# Altium project PCB_Project.PrjPCB (part 2 of 2)

## Sheet PWR_IN.SchDoc
size C
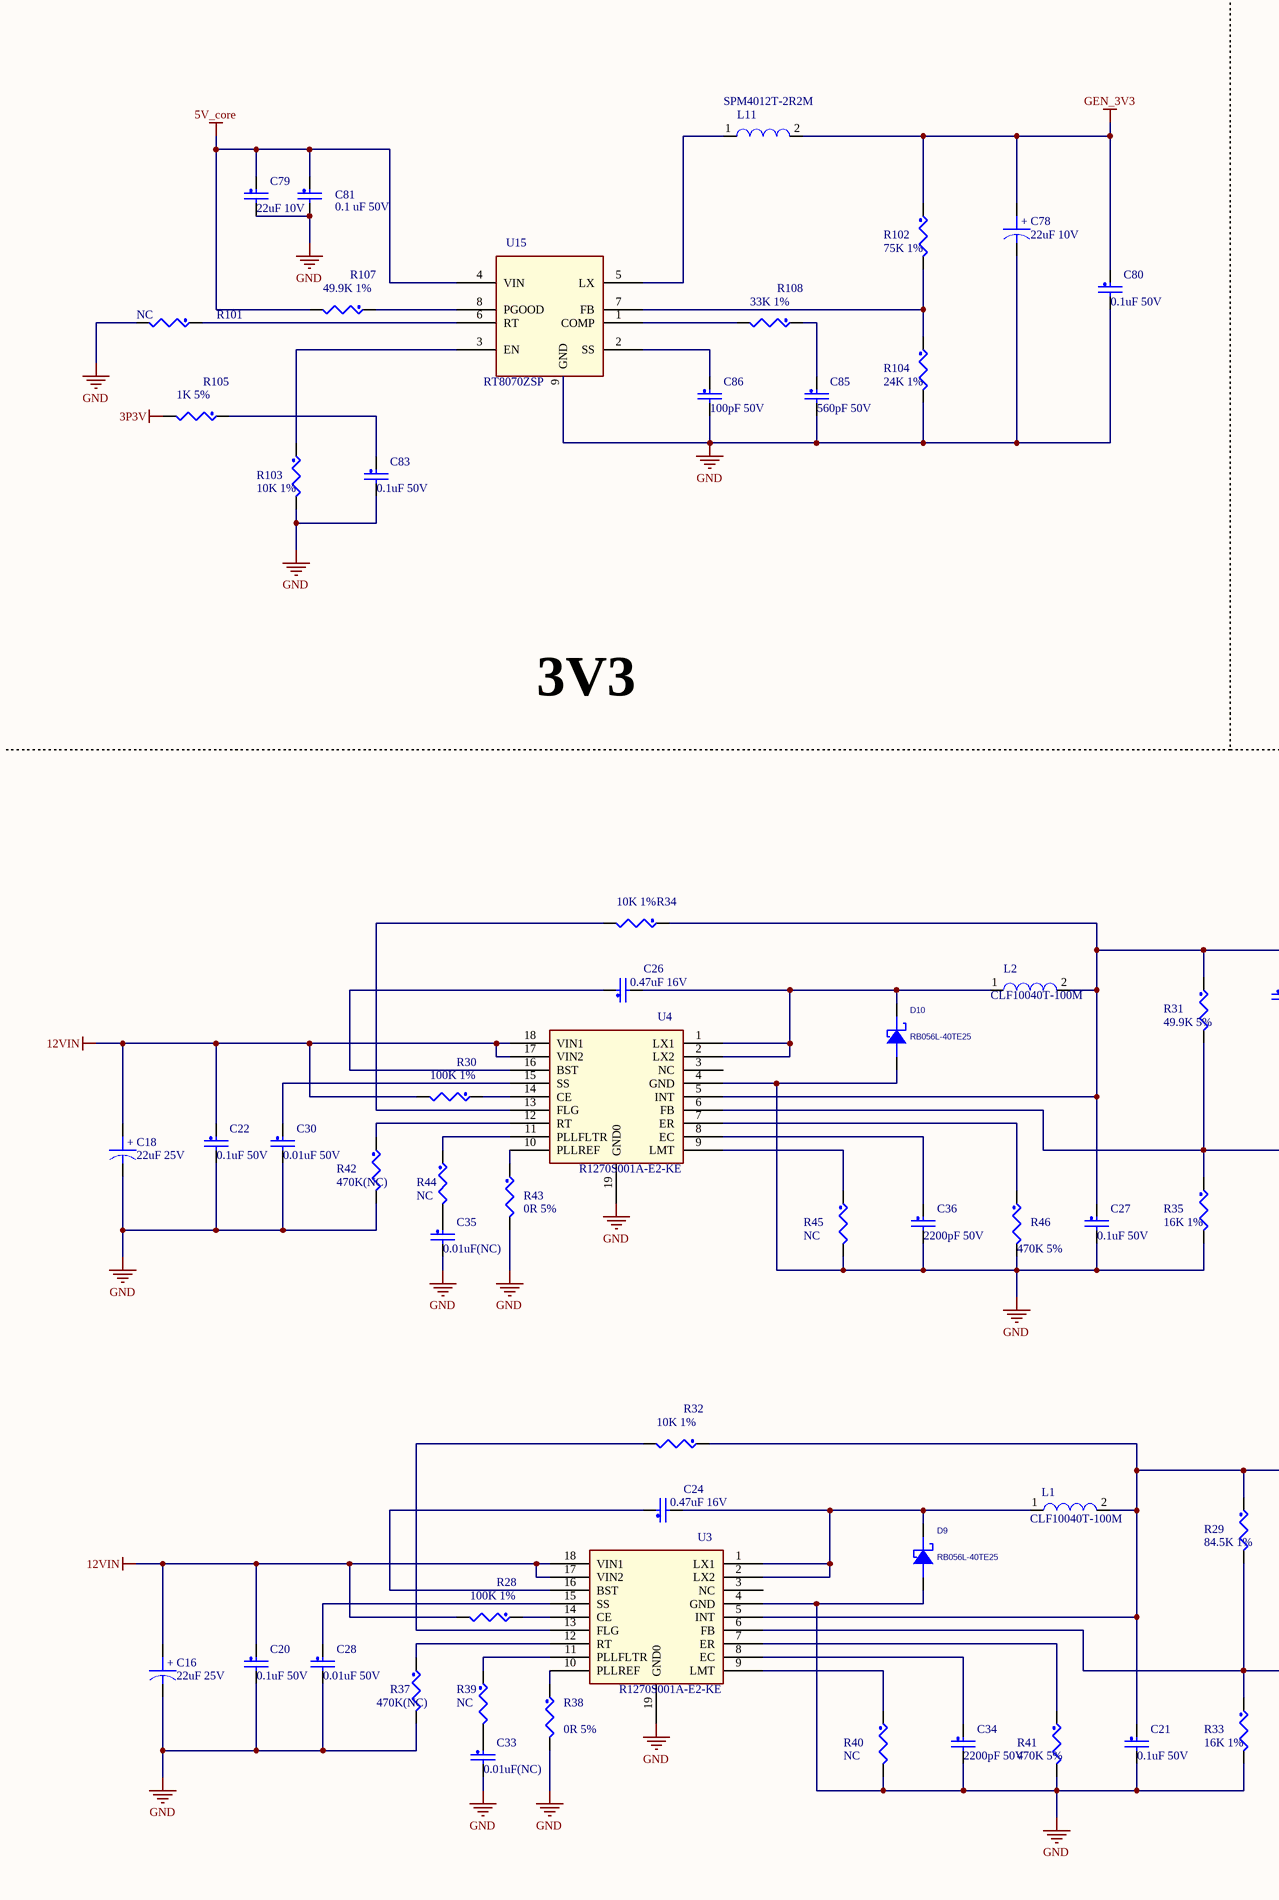
[diagram p9: PWR_IN.SchDoc, left]
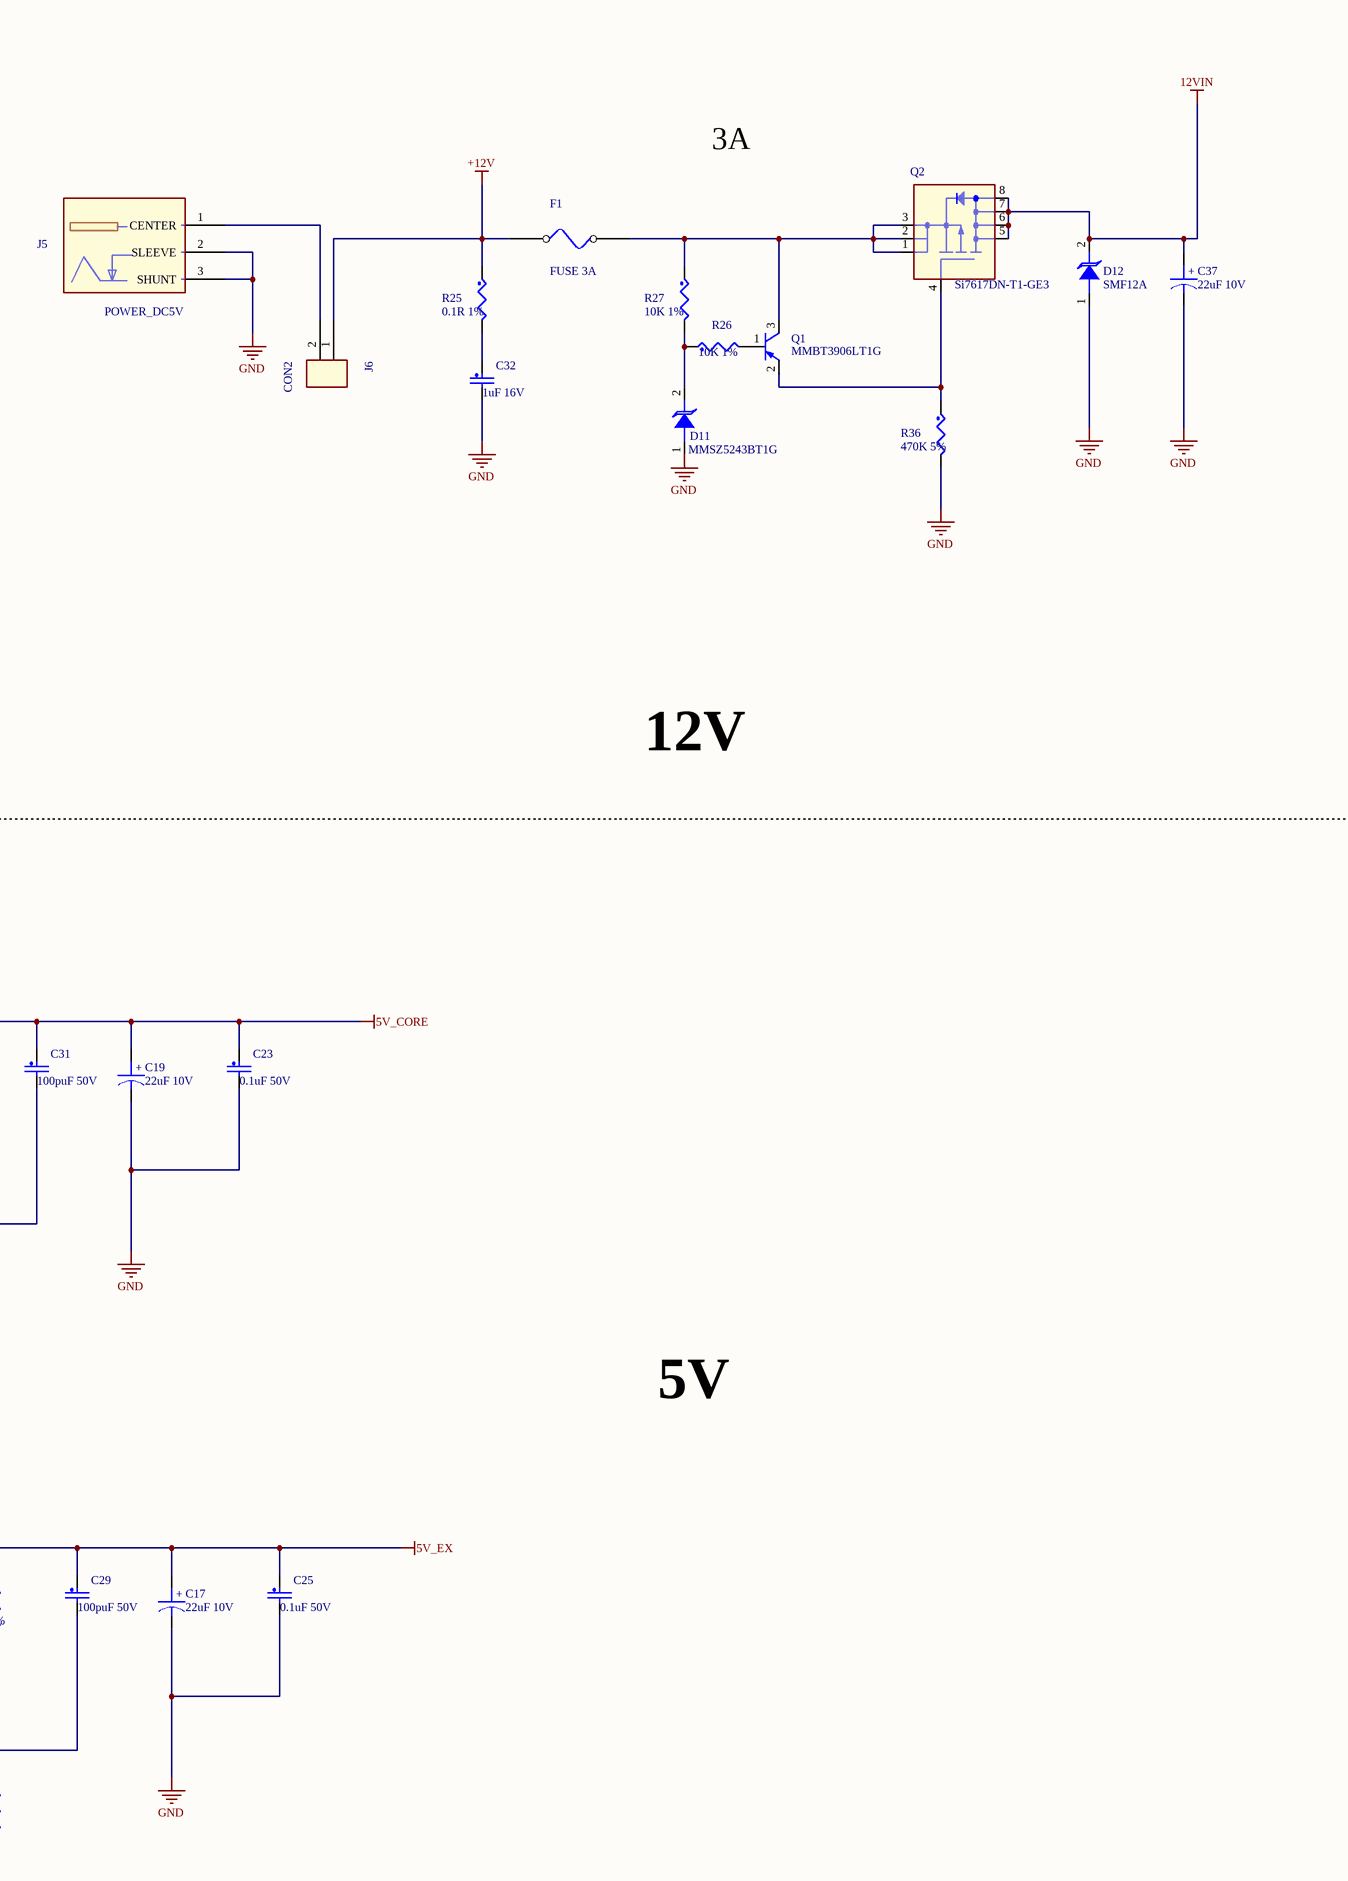
[diagram p10: PWR_IN.SchDoc, right]

### Parts
C16  22uF 25V  [SC0805]
C17  22uF 10V  [SC0805]
C18  22uF 25V  [SC0805]
C19  22uF 10V  [SC0805]
C20  0.1uF 50V  [SC0603]
C21  0.1uF 50V  [SC0603]
C22  0.1uF 50V  [SC0603]
C23  0.1uF 50V  [SC0603]
C24  0.47uF 16V  [SC0603]
C25  0.1uF 50V  [SC0603]
C26  0.47uF 16V  [SC0603]
C27  0.1uF 50V  [SC0603]
C28  0.01uF 50V  [SC0603]
C29  100puF 50V  [SC0603]
C30  0.01uF 50V  [SC0603]
C31  100puF 50V  [SC0603]
C32  1uF 16V  [SC0603]
C33  0.01uF(NC)  [SC0603]
C34  2200pF 50V  [SC0603]
C35  0.01uF(NC)  [SC0603]
C36  2200pF 50V  [SC0603]
C37  22uF 10V  [SC0805]
C78  22uF 10V  [SC0805]
C79  22uF 10V  [SC0603]
C80  0.1uF 50V  [SC0603]
C81  0.1 uF 50V  [SC0603]
C83  0.1uF 50V  [SC0603]
C85  560pF 50V  [SC0603]
C86  100pF 50V  [SC0603]
D9  RB056L-40TE25  [DO-214AC]
D10  RB056L-40TE25  [DO-214AC]
D11  MMSZ5243BT1G  [SOD123]
D12  SMF12A  [SOD123]
F1  FUSE 3A  [SF1812]
J5  POWER_DC5V  [DC-005-1P65]
J6  CON2  [SW2-10P4X15-1-8]
L1  CLF10040T-100M  [SPM10X9P7]
L2  CLF10040T-100M  [SPM10X9P7]
L11  SPM4012T-2R2M  [SPM4X4]
Q1  MMBT3906LT1G  [SOT23-3]
Q2  Si7617DN-T1-GE3  [QFN8-0P66-4P3X3P3]
R25  0.1R 1%  [SR0603]
R26  10K 1%  [SR0603]
R27  10K 1%  [SR0603]
R28  100K 1%  [SR0603]
R29  84.5K 1%  [SR0603]
R30  100K 1%  [SR0603]
R31  49.9K 5%  [SR0603]
R32  10K 1%  [SR0603]
R33  16K 1%  [SR0603]
R34  10K 1%  [SR0603]
R35  16K 1%  [SR0603]
R36  470K 5%  [SR0603]
R37  470K(NC)  [SR0603]
R38  0R 5%  [SR0603]
R39  NC  [SR0603]
R40  NC  [SR0603]
R41  470K 5%  [SR0603]
R42  470K(NC)  [SR0603]
R43  0R 5%  [SR0603]
R44  NC  [SR0603]
R45  NC  [SR0603]
R46  470K 5%  [SR0603]
R101  NC  [SR0603]
R102  75K 1%  [SR0603]
R103  10K 1%  [SR0603]
R104  24K 1%  [SR0603]
R105  1K 5%  [SR0603]
R107  49.9K 1%  [SR0603]
R108  33K 1%  [SR0603]
U3  R1270S001A-E2-KE  [HSOP18-0P5-5P2X4P4-P]
U4  R1270S001A-E2-KE  [HSOP18-0P5-5P2X4P4-P]
U15  RT8070ZSP  [SOP8-1P27-5X4-P]

### Nets
3P3V: R105.2
5V_core: C19.1 C23.1 C27.1 C31.1 C79.1 C81.1 L2.2 R31.1 R34.1 R107.2 U4.5(INT) U15.4(VIN)
5V_EX: C17.1 C21.1 C25.1 C29.1 L1.2 R29.1 R32.1 U3.5(INT)
12VIN: C16.1 C18.1 C20.1 C22.1 C37.1 D12.2(C) Q2.5(D5) Q2.6(D6) Q2.7(D7) Q2.8(D8) R28.2 R30.2 U3.17(VIN2) U3.18(VIN1) U4.17(VIN2) U4.18(VIN1)
+12V: F1.1 J6.1 R25.1
GEN_3V3: C78.1 C80.1 L11.2 R102.1
GND: C16.2 C17.2 C18.2 C19.2 C20.2 C21.2 C22.2 C23.2 C25.2 C27.2 C28.2 C30.2 C32.2 C33.2 C34.2 C35.2 C36.2 C37.2 C78.2 C79.2 C80.2 C81.2 C83.2 C85.2 C86.2 D9.1(ANODE) D10.1(ANODE) D11.1(A) D12.1(A) J5.2(SLEEVE) J5.3(SHUNT) R33.2 R35.2 R36.2 R37.2 R38.2 R40.2 R41.2 R42.2 R43.2 R45.2 R46.2 R101.2 R103.2 R104.2 U3.4(GND) U3.19(GND0) U4.4(GND) U4.19(GND0) U15.9(GND)
NetC24_1: C24.1 U3.16(BST)
NetC24_2: C24.2 D9.2(CATHODE) L1.1 U3.1(LX1) U3.2(LX2)
NetC26_1: C26.1 U4.16(BST)
NetC26_2: C26.2 D10.2(CATHODE) L2.1 U4.1(LX1) U4.2(LX2)
NetC28_1: C28.1 U3.15(SS)
NetC29_2: C29.2 R29.2 R33.1 U3.6(FB)
NetC30_1: C30.1 U4.15(SS)
NetC31_2: C31.2 R31.2 R35.1 U4.6(FB)
NetC32_1: C32.1 R25.2
NetC33_1: C33.1 R39.2
NetC34_1: C34.1 U3.8(EC)
NetC35_1: C35.1 R44.2
NetC36_1: C36.1 U4.8(EC)
NetC83_1: C83.1 R105.1
NetC85_1: C85.1 R108.1
NetC86_1: C86.1 U15.2(SS)
NetD11_2: D11.2(C) R26.1 R27.2
NetF1_2: F1.2 Q1.3(O) Q2.1(S1) Q2.2(S2) Q2.3(S3) R27.1
NetJ5_1: J5.1(CENTER) J6.2
NetL11_1: L11.1 U15.5(LX)
NetQ1_1: Q1.1(B) R26.2
NetQ1_2: Q1.2(E) Q2.4(G) R36.1
NetR28_1: R28.1 U3.14(CE)
NetR30_1: R30.1 U4.14(CE)
NetR32_2: R32.2 U3.13(FLG)
NetR34_2: R34.2 U4.13(FLG)
NetR37_1: R37.1 U3.12(RT)
NetR38_1: R38.1 U3.10(PLLREF)
NetR39_1: R39.1 U3.11(PLLFLTR)
NetR40_1: R40.1 U3.9(LMT)
NetR41_1: R41.1 U3.7(ER)
NetR42_1: R42.1 U4.12(RT)
NetR43_1: R43.1 U4.10(PLLREF)
NetR44_1: R44.1 U4.11(PLLFLTR)
NetR45_1: R45.1 U4.9(LMT)
NetR46_1: R46.1 U4.7(ER)
NetR101_1: R101.1 U15.6(RT)
NetR102_2: R102.2 R104.1 U15.7(FB)
NetR103_1: R103.1 U15.3(EN)
NetR107_1: R107.1 U15.8(PGOOD)
NetR108_2: R108.2 U15.1(COMP)

Not connected (* = marked no-connect by the designer): U3 3(NC); U4 3(NC)

### Notes on the sheet
- 3A
- 12V
- 3V3
- 5V
- (in symbol CAP POL) +

### Library data of the parts
C16-C19 C37 C78 = CAP POL
C20-C36 C79-C81 C83 C85 C86 = CAP_NP: CLASS: DISCRETE
D9 D10 = DIODE SCHOTTKY
D11 D12 = DIODE TAZ_5
F1 = FUSE
J5 = POWER_IN_1
L1 L2 L11 = INDUCTOR_Dup1: CLASS: DISCRETE
Q1 = PNP DIAC_0
R25-R46 R101-R105 R107 R108 = RES: CLASS: DISCRETE
U3 U4 = R1270S_2
U15 = SON8_2

## Sheet UART.SchDoc
size A4
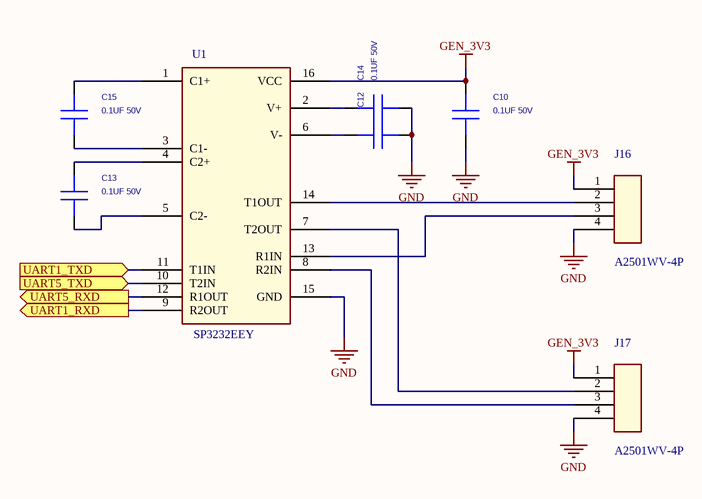
[diagram p11: UART.SchDoc]

### Parts
C10  0.1UF 50V  [SC0603]
C12  0.1UF 50V  [SC0603]  (value not drawn)
C13  0.1UF 50V  [SC0603]
C14  0.1UF 50V  [SC0603]
C15  0.1UF 50V  [SC0603]
J16  A2501WV-4P  [A2501WV-4P]
J17  A2501WV-4P  [A2501WV-4P]
U1  SP3232EEY  [TSSOP16-0P65-5P1X4P5]

### Ports
UART1_RXD (out), UART1_TXD (in), UART5_RXD (out), UART5_TXD (in)

### Nets
GEN_3V3: C10.1 J16.1 J17.1 U1.16(VCC)
GND: C10.2 C12.2 C14.2 J16.4 J17.4 U1.15(GND)
NetC12_1: C12.1 U1.6(V-)
NetC13_1: C13.1 U1.4(C2+)
NetC13_2: C13.2 U1.5(C2-)
NetC14_1: C14.1 U1.2(V+)
NetC15_1: C15.1 U1.1(C1+)
NetC15_2: C15.2 U1.3(C1-)
NetJ16_2: J16.2 U1.14(T1OUT)
NetJ16_3: J16.3 U1.13(R1IN)
NetJ17_2: J17.2 U1.7(T2OUT)
NetJ17_3: J17.3 U1.8(R2IN)
NetMXM314-92p2x9p6-0p5-socket_WH_P4: U1.9(R2OUT) ; port UART1_RXD
NetMXM314-92p2x9p6-0p5-socket_WH_P5: U1.11(T1IN) ; port UART1_TXD
NetMXM314-92p2x9p6-0p5-socket_WH_P11: U1.12(R1OUT) ; port UART5_RXD
NetMXM314-92p2x9p6-0p5-socket_WH_P12: U1.10(T2IN) ; port UART5_TXD

### Library data of the parts
C10 C12-C15 = 0.1uF-6.3V-10%-X5R-0402: Capacitor, 0.1uF, 50V, 10%, X5R, 0603; Cost_100: 0.0184; Cost_1K: 0.01005; Dist1: Digikey; Dist1_PN: PCC2146CT-ND; Device: CAP0402; Mfg1_PN: ECJ-0EB1A104K; Mfg1: Panasonic; Voltage: 6.3V; Cost_Reel: 0.00871; Mfg2_PN: MCCJ104K0NRTF; DNP: No; Cost: 0.026; Dielectric: X5R; TOLERANCE: 10%; Mfg2: SMEC
J16 J17 = CON4

## Sheet USB.SchDoc
size A2
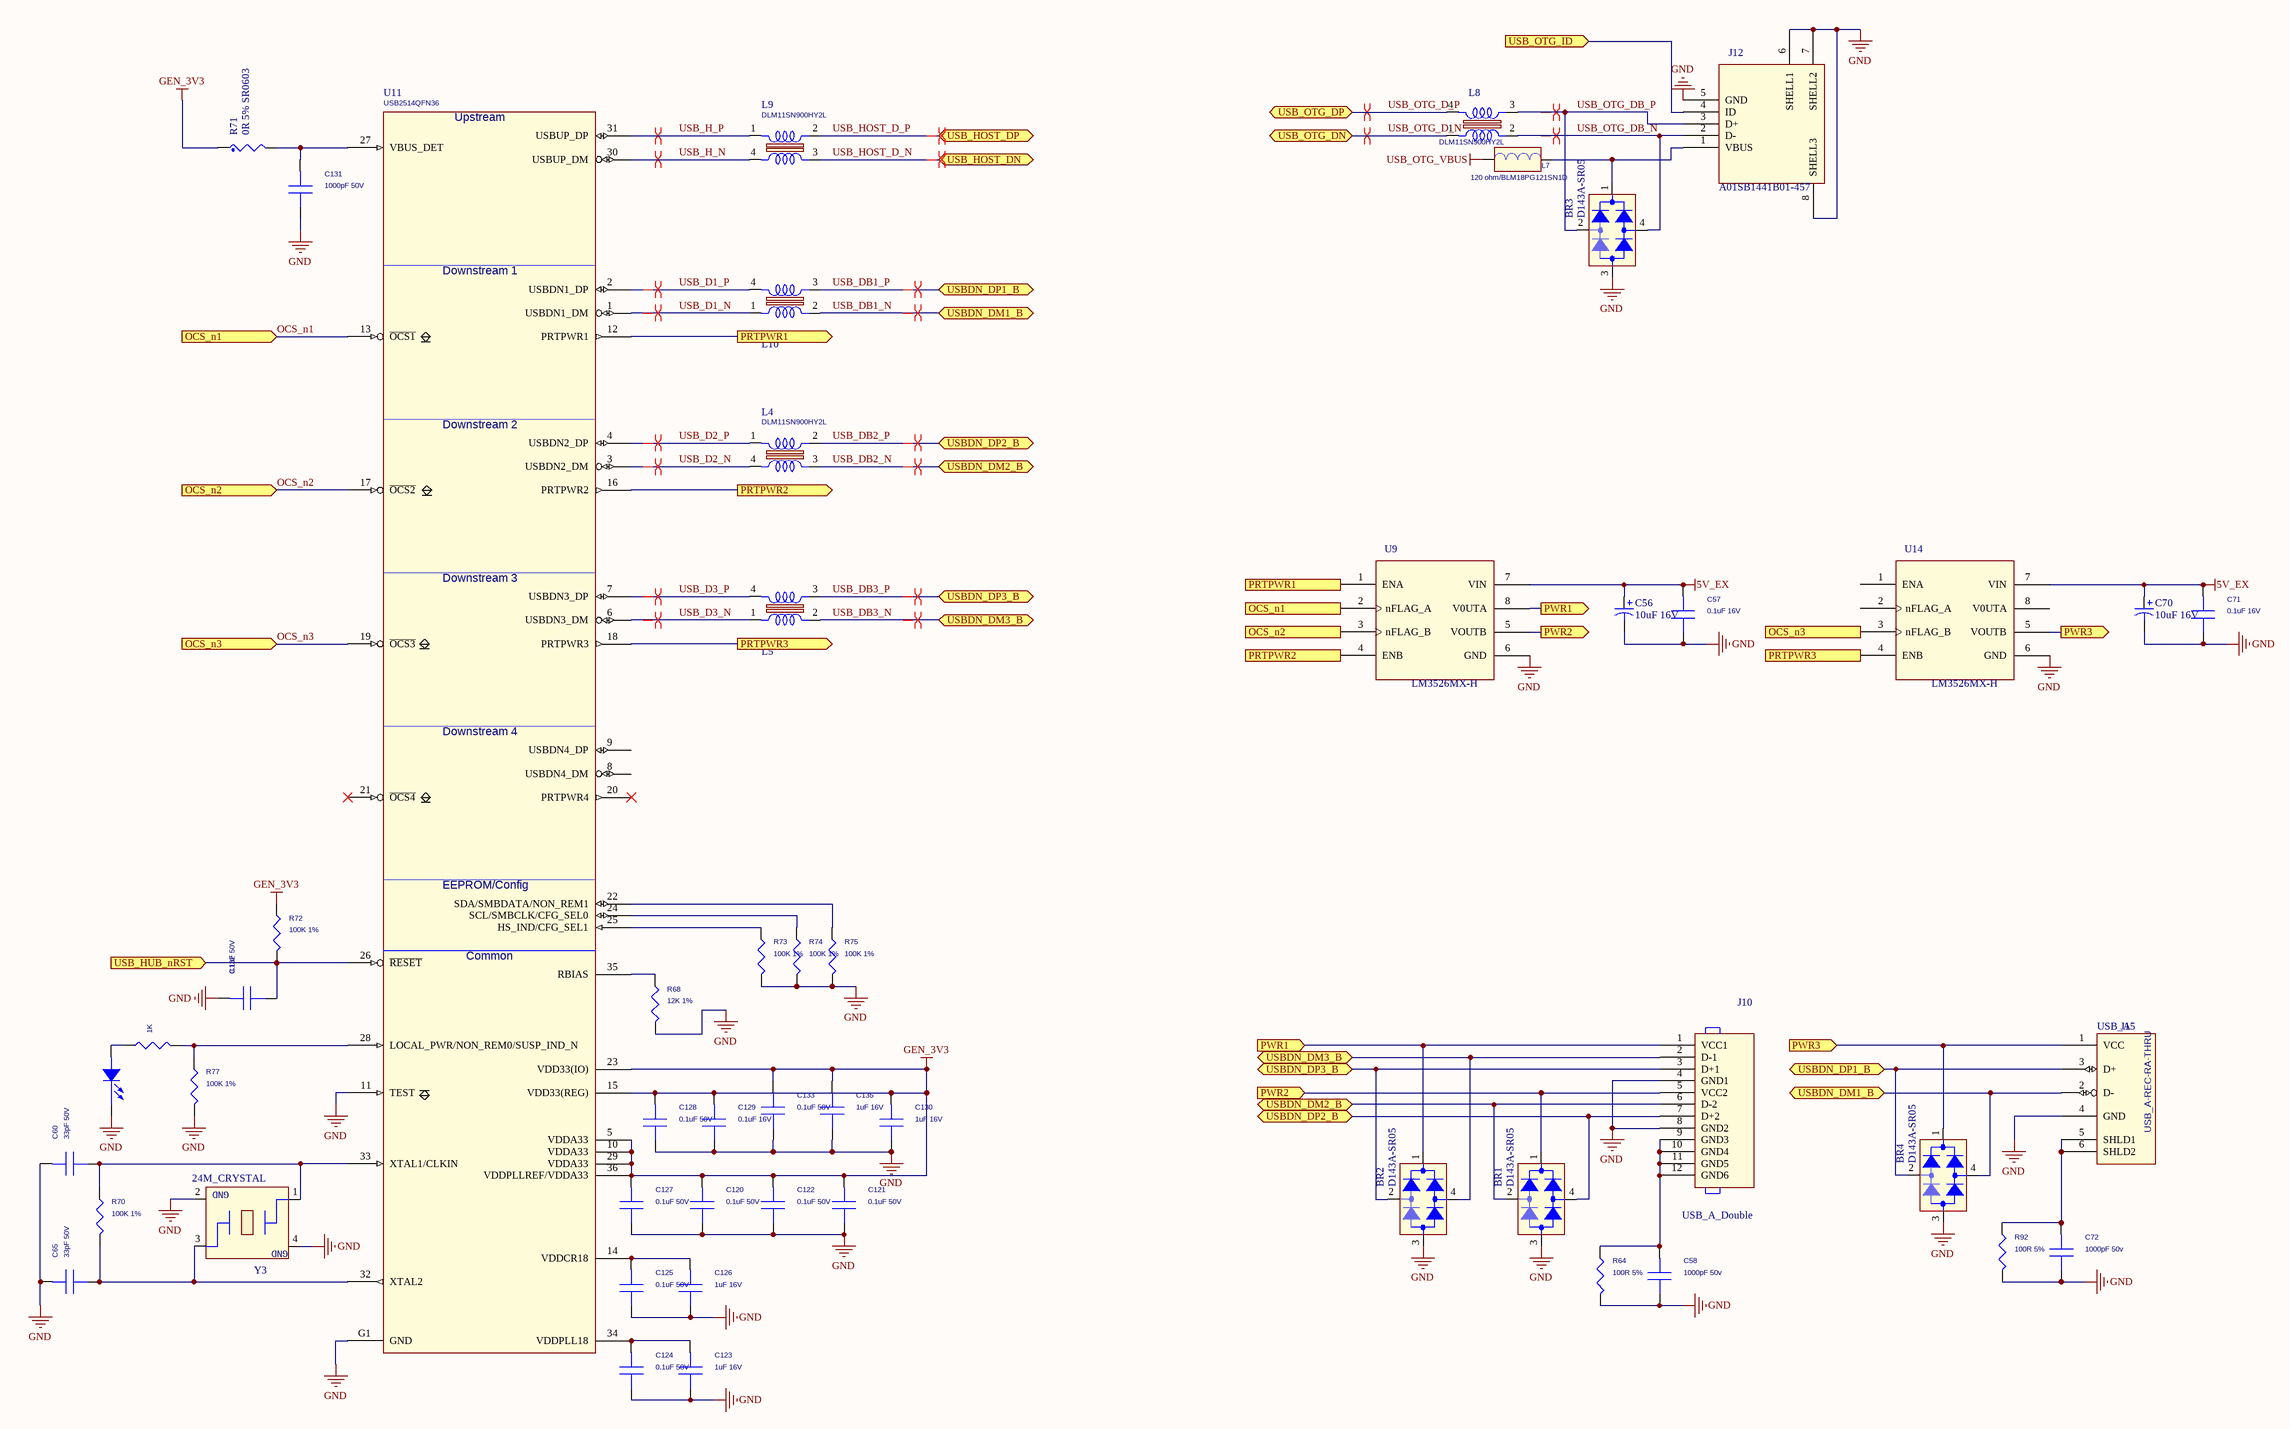
[diagram p12: USB.SchDoc]

### Parts
BR1  D143A-SR05  [SOT143]
BR2  D143A-SR05  [SOT143]
BR3  D143A-SR05  [SOT143]
BR4  D143A-SR05  [SOT143]
C56  10uF 16V  [SC0805]
C57  0.1uF 16V  [SC0603]
C58  1000pF 50v  [SC0603]
C60  33pF 50V  [SC0603]
C65  33pF 50V  [SC0603]
C70  10uF 16V  [SC0805]
C71  0.1uF 16V  [SC0603]
C72  1000pF 50v  [SC0603]
C120  0.1uF 50V  [SC0603]
C121  0.1uF 50V  [SC0603]
C122  0.1uF 50V  [SC0603]
C123  1uF 16V  [SC0603]
C124  0.1uF 50V  [SC0603]
C125  0.1uF 50V  [SC0603]
C126  1uF 16V  [SC0603]
C127  0.1uF 50V  [SC0603]
C128  0.1uF 50V  [SC0603]
C129  0.1uF 16V  [SC0603]
C130  1uF 16V  [SC0603]
C131  1000pF 50V  [SC0603]
C132  0.1uF 50V  [SC0603]
C133  0.1uF 50V  [SC0603]
C135  1uF 16V  [SC0603]
D15  LED_RED  [SD0603]  (value not drawn)
J10  USB_A_Double  [DUSB-TYPEA-LIANSHENG]
J12  A01SB1441B01-457  [USB-MICRO-B-LIANSHENG-C]
J15  USB_A  [USB-TYPBEA-ZXHS-V]
L4  DLM11SN900HY2L  [SPM2P1X1P3]
L5  DLM11SN900HY2L  [SPM2P1X1P3]
L7  120 ohm/BLM18PG121SN1D  [SFB0603]
L8  DLM11SN900HY2L  [SPM2P1X1P3]
L9  DLM11SN900HY2L  [SPM2P1X1P3]
L10  DLM11SN900HY2L  [SPM2P1X1P3]
R64  100R 5%  [SR0603]
R68  12K 1%  [SR0603]
R70  100K 1%  [SR0603]
R71  0R 5% SR0603  [SR0603]
R72  100K 1%  [SR0603]
R73  100K 1%  [SR0603]
R74  100K 1%  [SR0603]
R75  100K 1%  [SR0603]
R76  1K  [SR0603]
R77  100K 1%  [SR0603]
R92  100R 5%  [SR0603]
U9  LM3526MX-H  [SOP8-1p27-5x4]
U11  Device: USB2514QFN36  [QFP36-0P5-6X6]  (hidden comment: USB2514_QFN36_0)
U14  LM3526MX-H  [SOP8-1p27-5x4]
Y3  24M_CRYSTAL  [SCRY4-3P2X2P5]

### Ports
OCS_n1 (in), OCS_n1 (out), OCS_n2 (in), OCS_n2 (out), OCS_n3 (in), OCS_n3 (out), PRTPWR1 (out), PRTPWR2 (out), PRTPWR3 (out), PWR1 (in), PWR1 (out), PWR2 (in), PWR2 (out), PWR3 (in), PWR3 (out), USB_HOST_DN (bidir), USB_HOST_DP (bidir), USB_HUB_nRST (in), USB_OTG_DN (bidir), USB_OTG_DP (bidir), USB_OTG_ID (in), USBDN_DM1_B (bidir), USBDN_DM2_B (bidir), USBDN_DM3_B (bidir), USBDN_DP1_B (bidir), USBDN_DP2_B (bidir), USBDN_DP3_B (bidir)

### Nets
5V_EX: C56.1 C57.1 C70.1 C71.1 U9.7(VIN) U14.7(VIN)
GEN_3V3: C120.1 C121.1 C122.1 C127.1 C128.1 C129.1 C130.1 C133.1 C135.1 R71.1 R72.1 U11.5(VDDA33) U11.10(VDDA33) U11.15(VDD33(REG)) U11.23(VDD33(IO)) U11.29(VDDA33) U11.36(VDDPLLREF/VDDA33)
GND: BR1.3 BR2.3 BR3.3 BR4.3 C56.2 C57.2 C58.2 C60.1 C65.1 C70.2 C71.2 C72.2 C120.2 C121.2 C122.2 C123.2 C124.2 C125.2 C126.2 C127.2 C128.2 C129.2 C130.2 C131.2 C132.1 C133.2 C135.2 D15.2(CATHODE) J10.4(GND1) J10.8(GND2) J12.5(GND) J12.6(SHELL1) J12.7(SHELL2) J12.8(SHELL3) J15.4(GND) R64.2 R68.2 R73.2 R74.2 R75.2 R77.2 R92.2 U9.6(GND) U11.11(TEST) U11.G1(GND) U14.6(GND) Y3.2(GND2) Y3.4(GND1)
USB_OTG_VBUS: L7.1
OCS_n1: U9.2(nFLAG_A) U11.13(~{OCS1}) ; port OCS_n1
OCS_n2: U9.3(nFLAG_B) U11.17(~{OCS2}) ; port OCS_n2
OCS_n3: U11.19(~{OCS3}) U14.3(nFLAG_B) ; port OCS_n3
USB_D1_N: L10.1 U11.1(USBDN1_DM)
USB_D1_P: L10.4 U11.2(USBDN1_DP)
USB_D2_N: L4.4 U11.3(USBDN2_DM)
USB_D2_P: L4.1 U11.4(USBDN2_DP)
USB_D3_N: L5.1 U11.6(USBDN3_DM)
USB_D3_P: L5.4 U11.7(USBDN3_DP)
USB_DB1_N: BR4.4 J15.2(D-) L10.2 ; port USBDN_DM1_B
USB_DB1_P: BR4.2 J15.3(D+) L10.3 ; port USBDN_DP1_B
USB_DB2_N: BR1.2 J10.6(D-2) L4.3 ; port USBDN_DM2_B
USB_DB2_P: BR1.4 J10.7(D+2) L4.2 ; port USBDN_DP2_B
USB_DB3_N: BR2.4 J10.2(D-1) L5.2 ; port USBDN_DM3_B
USB_DB3_P: BR2.2 J10.3(D+1) L5.3 ; port USBDN_DP3_B
USB_H_N: L9.4 U11.30(USBUP_DM)
USB_H_P: L9.1 U11.31(USBUP_DP)
USB_HOST_D_N: L9.3 ; port USB_HOST_DN
USB_HOST_D_P: L9.2 ; port USB_HOST_DP
USB_OTG_D_N: L8.1 ; port USB_OTG_DN
USB_OTG_D_P: L8.4 ; port USB_OTG_DP
USB_OTG_DB_N: BR3.4 J12.2(D-) L8.2
USB_OTG_DB_P: BR3.2 J12.3(D+) L8.3
NetBR1_1: BR1.1 J10.5(VCC2) U9.5(VOUTB) ; port PWR2
NetBR2_1: BR2.1 J10.1(VCC1) U9.8(V0UTA) ; port PWR1
NetBR3_1: BR3.1 J12.1(VBUS) L7.2
NetBR4_1: BR4.1 J15.1(VCC) U14.5(VOUTB) ; port PWR3
NetC58_1: C58.1 J10.9(GND3) J10.10(GND4) J10.11(GND5) J10.12(GND6) R64.1
NetC60_2: C60.2 R70.1 U11.33(XTAL1/CLKIN) Y3.1
NetC65_2: C65.2 R70.2 U11.32(XTAL2) Y3.3
NetC72_1: C72.1 J15.5(SHLD1) J15.6(SHLD2) R92.1
NetC123_1: C123.1 C124.1 U11.34(VDDPLL18)
NetC125_1: C125.1 C126.1 U11.14(VDDCR18)
NetC131_1: C131.1 R71.2 U11.27(VBUS_DET)
NetC132_2: C132.2 R72.2 U11.26(~{RESET}) ; port USB_HUB_nRST
NetD15_1: D15.1(ANODE) R76.1
NetJ12_4: J12.4(ID) ; port USB_OTG_ID
NetR68_1: R68.1 U11.35(RBIAS)
NetR73_1: R73.1 U11.25(HS_IND/CFG_SEL1)
NetR74_1: R74.1 U11.24(SCL/SMBCLK/CFG_SEL0)
NetR75_1: R75.1 U11.22(SDA/SMBDATA/NON_REM1)
NetR76_2: R76.2 R77.1 U11.28(LOCAL_PWR/NON_REM0/SUSP_IND_N)
NetU9_1: U9.1(ENA) U11.12(PRTPWR1) ; port PRTPWR1
NetU9_4: U9.4(ENB) U11.16(PRTPWR2) ; port PRTPWR2
NetU11_18: U11.18(PRTPWR3) U14.4(ENB) ; port PRTPWR3

Not connected (* = marked no-connect by the designer): U11 8(USBDN4_DM) 9(USBDN4_DP) 20(PRTPWR4)* 21(~{OCS4})*; U14 1(ENA) 2(nFLAG_A) 8(V0UTA)

### Layout directives
differential pair: USB_D1_N, USB_D1_P, USB_D2_N, USB_D2_P, USB_D3_N, USB_D3_P, USB_DB1_N, USB_DB1_P, USB_DB2_N, USB_DB2_P, USB_DB3_N, USB_DB3_P, USB_H_N, USB_H_P, USB_HOST_D_N, USB_HOST_D_P, USB_OTG_D_N, USB_OTG_D_P, USB_OTG_DB_N, USB_OTG_DB_P

### Notes on the sheet
- (in symbol 24M_CRYSTAL) GND
- (in symbol SKT_USB-A_THRU_RA_0) USB_A-REC-RA-THRU
- (in symbol USB2514_QFN36_0) Upstream; Downstream 1; Downstream 2; Downstream 3; Downstream 4; EEPROM/Config; Common

### Library data of the parts
BR1-BR4 = DIO_BRIDGE_BGX50A_KCAC_SOT143: SOT143; Cost_100: 0.165; Cost_10: 0.234; Cost_1K: 0.075; Cost_Reel: 0.06113; Dist1: Digikey; Dist1_PN: BGX50AINCT-ND; Device: DIODE_KCAC_BRIDGE_BGX50A; Mfg1: Infineon Tech; Mfg1_PN: BGX50A; DNP: No
C56 C70 = Cap Pol1: Polarized Capacitor (Radial); Published: 8-Jun-2000; LatestRevisionDate: 17-Jul-2002; LatestRevisionNote: Re-released for DXP Platform.; PackageReference: RB7.6-15; Publisher: Altium Limited
C57 C58 C60 C65 C71 C72 C120-C122 C124 C125 C127-C129 C131-C133 = 0.1uF-6.3V-10%-X5R-0402: as C10 on sheet UART; Cost: 0.026; Dielectric: X5R; TOLERANCE: 10%; Mfg2: SMEC
C123 C126 = 0.1uF-6.3V-10%-X5R-0402: Capacitor, 1uF, 16V, 10%, X5R, 0603; Cost_100: 0.0184; Cost_1K: 0.01005; Dist1: Digikey; Dist1_PN: PCC2146CT-ND; Device: CAP0402; Mfg1_PN: ECJ-0EB1A104K; Mfg1: Panasonic; Voltage: 6.3V; Cost_Reel: 0.00871; Mfg2_PN: MCCJ104K0NRTF; DNP: No; Cost: 0.026; Dielectric: X5R; TOLERANCE: 10%; Mfg2: SMEC
C130 = 0.1uF-6.3V-10%-X5R-0402: Capacitor,1uF, 16V, 10%, X5R, 0603; Cost_100: 0.0184; Cost_1K: 0.01005; Dist1: Digikey; Dist1_PN: PCC2146CT-ND; Device: CAP0402; Mfg1_PN: ECJ-0EB1A104K; Mfg1: Panasonic; Voltage: 6.3V; Cost_Reel: 0.00871; Mfg2_PN: MCCJ104K0NRTF; DNP: No; Cost: 0.026; Dielectric: X5R; TOLERANCE: 10%; Mfg2: SMEC
C135 = 0.1uF-6.3V-10%-X5R-0402: Capacitor, 1uF, 50V, 10%, X5R, 0603; Cost_100: 0.0184; Cost_1K: 0.01005; Dist1: Digikey; Dist1_PN: PCC2146CT-ND; Device: CAP0402; Mfg1_PN: ECJ-0EB1A104K; Mfg1: Panasonic; Voltage: 6.3V; Cost_Reel: 0.00871; Mfg2_PN: MCCJ104K0NRTF; DNP: No; Cost: 0.026; Dielectric: X5R; TOLERANCE: 10%; Mfg2: SMEC
D15 = LED
J10 = 12 HEADER_0: DUSB-TypeA-LianSheng
J12 = MICRO_USB_CONN_0: USB-Micro-B-LianSheng-C; CLASS: IO
J15 = SKT_USB-A_THRU_RA_0: USB-TypbeA-ZXHS-V; Cost_Reel: 0.6205; Dist1: Digikey; Dist1_PN: 787616-1-ND; Mfg1_PN: 787616-1; Mfg2_PN: USB-A-S-RA; Mfg1: AMP; SDTSourceLibName: C:\WINDOWS\EFE9203.LIB; Cost_100: 0.7476; DNP: No; Cost: 1.12; Mfg2: Adam Tech; Device: SKT_USB-A; Cost_1K: 0.6205
L4 L5 L9 L10 = CHOKE_C-MODE_0: Inductor, Common Mode Choke, DLP11SN900SL2, 0504; Cost_100: 0.32; Cost_1K: 0.26; Dist1_PN: 81-DLP11SN900SL2L; Mfg1: Murata; Dist1: Mouser; Device: 0504CHOKE; DNP: No; Mfg2_PN: EXC-24CE201U; Cost: 0.56; Mfg1_PN: DLP11SN900SL2; Mfg2: Panasonic
L7 = BEAD: SFB0603
L8 = CHOKE_C-MODE_0: SPM2p1x1p3; Cost_100: 0.32; Cost_1K: 0.26; Dist1_PN: 81-DLP11SN900SL2L; Mfg1: Murata; Dist1: Mouser; Mfg1_PN: DLP11SN900SL2; Device: 0504CHOKE; DNP: No; Mfg2_PN: EXC-24CE201U; Cost: 0.56; Mfg2: Panasonic
R64 R92 = 100K-1/16W-5%-0603: Resistor, 100K, 1%, 0603; DNP: No; Cost_100: 0.0412; Cost_1K: 0.01612; Cost_Reel: 0.02365; Dist1: Digikey; Dist1_PN: 311-100KGCT-ND; Wattage: 1/16W; Device: RES0603; Mfg1: Yageo America; Mfg2_PN: MCR03EZHJ104; Mfg1_PN: 9C06031A1003JLHFT; Cost: 0.076; Tolerance: 5%; Mfg2: Rohm
R68 R70 R72-R75 R77 = 100K-1/16W-5%-0603: Resistor, 100K, 1%, 0603; DNP: No; Cost_100: 0.0412; Cost_1K: 0.01612; Cost_Reel: 0.02365; Dist1: Digikey; Dist1_PN: 311-100KGCT-ND; Wattage: 1/16W; Tolerance: 5%; Device: RES0603; Mfg1: Yageo America; Mfg2_PN: MCR03EZHJ104; Mfg1_PN: 9C06031A1003JLHFT; Cost: 0.076; Mfg2: Rohm
R71 = RES: CLASS: DISCRETE
R76 = 1.0K-1/16W-5%-0603: Resistor, 1K, 5%, 1/16W, 0603; DNP: No; Mfg3_PN: RK73B1JLTD102J; Dist1: Digikey; Dist1_PN: 311-1.0KGCT-ND; Mfg1_PN: 9C06031A1001JLHFT; Mfg2_PN: MCR03EZHJ102; Mfg1: Yageo America; Device: RES0603; Cost_Reel: 0.00468; Cost_1K: 0.01612; Cost_100: 0.0412; Mfg3: KOA Speer; Cost: 0.076; Mfg2: KOA Speer; Tolerance: 5%; Wattage: 1/16W
U9 U14 = LM3526-L: SOP8-1p27-5x4
U11 = USB2514_QFN36_0: IC, USB2514, 4 Port USB 2.0 Hub, QFN36; Mfg1_PN: USB2514-AEZG; Mfg1: SMSC; Cost_Reel: 0; DNP: No; Cost: 0; Cost_1K: 0; Cost_100: 0
Y3 = 24M_CRYSTAL: SCRY4-3p2x2p5

## Nets that join several sheets
2P5V: Connector (MXM314-92p2x9p6-0p5-socket_WH.P149 MXM314-92p2x9p6-0p5-socket_WH.P150), Ethernet (11 pins)
3P3V: Button (SW1.1 SW1.2), Connector (MXM314-92p2x9p6-0p5-socket_WH.S149 MXM314-92p2x9p6-0p5-socket_WH.S150 MXM314-92p2x9p6-0p5-socket_WH.S151 MXM314-92p2x9p6-0p5-socket_WH.S152), PWR_IN (R105.2)
5V_core: Connector (9 pins), PWR_IN (12 pins)
5V_EX: Button (D17.1 D18.1 D19.1), HDMI (C62.1 C63.1 R69.1 U13.1), LVDS (5 pins), PWR_IN (8 pins), USB (6 pins)
GEN_3V3: Button (21 pins), Ethernet (C43.1 L12.1 U6.1 U6.3), HDMI (5 pins), Key-RTC (7 pins), PWR_IN (C78.1 C80.1 L11.2 R102.1), UART (C10.1 J16.1 J17.1 U1.16), USB (17 pins)
GND: Button (36 pins), Connector (73 pins), Ethernet (42 pins), HDMI (25 pins), Key-RTC (11 pins), LVDS (10 pins), PWR_IN (50 pins), UART (6 pins), USB (48 pins)
USB_OTG_VBUS: Connector (MXM314-92p2x9p6-0p5-socket_WH.P103), USB (L7.1)
HDMI_CLK_N: Connector (MXM314-92p2x9p6-0p5-socket_WH.S135), HDMI (U13.15)
HDMI_CLK_P: Connector (MXM314-92p2x9p6-0p5-socket_WH.S134), HDMI (U13.13)
HDMI_D0_N: Connector (MXM314-92p2x9p6-0p5-socket_WH.S143), HDMI (U13.12)
HDMI_D0_P: Connector (MXM314-92p2x9p6-0p5-socket_WH.S144), HDMI (U13.10)
HDMI_D1_N: Connector (MXM314-92p2x9p6-0p5-socket_WH.S138), HDMI (U13.9)
HDMI_D1_P: Connector (MXM314-92p2x9p6-0p5-socket_WH.S137), HDMI (U13.7)
HDMI_D2_N: Connector (MXM314-92p2x9p6-0p5-socket_WH.S141), HDMI (U13.6)
HDMI_D2_P: Connector (MXM314-92p2x9p6-0p5-socket_WH.S140), HDMI (U13.4)
LVDS1_CLK_N: Connector (MXM314-92p2x9p6-0p5-socket_WH.S40), LVDS (J11.13)
LVDS1_CLK_P: Connector (MXM314-92p2x9p6-0p5-socket_WH.S41), LVDS (J11.14)
LVDS1_TX0_N: Connector (MXM314-92p2x9p6-0p5-socket_WH.S38), LVDS (J11.5)
LVDS1_TX0_P: Connector (MXM314-92p2x9p6-0p5-socket_WH.S37), LVDS (J11.4)
LVDS1_TX1_N: Connector (MXM314-92p2x9p6-0p5-socket_WH.S35), LVDS (J11.1)
LVDS1_TX1_P: Connector (MXM314-92p2x9p6-0p5-socket_WH.S34), LVDS (J11.2)
LVDS1_TX2_N: Connector (MXM314-92p2x9p6-0p5-socket_WH.S43), LVDS (J11.11)
LVDS1_TX2_P: Connector (MXM314-92p2x9p6-0p5-socket_WH.S44), LVDS (J11.10)
LVDS1_TX3_N: Connector (MXM314-92p2x9p6-0p5-socket_WH.S47), LVDS (J11.7)
LVDS1_TX3_P: Connector (MXM314-92p2x9p6-0p5-socket_WH.S46), LVDS (J11.8)
NetC8_1: Button (C8.1 KEY8.3 KEY8.4 R21.2), Connector (MXM314-92p2x9p6-0p5-socket_WH.P148)
NetC51_1: Connector (MXM314-92p2x9p6-0p5-socket_WH.P79), Ethernet (C51.1 D13.1 R55.2 U8.42)
NetC68_1: Connector (MXM314-92p2x9p6-0p5-socket_WH.S146), HDMI (C68.1 R85.2 U13.19)
NetC87_1: Connector (MXM314-92p2x9p6-0p5-socket_WH.P144), Key-RTC (C87.1 R112.2 U2.15)
NetC132_2: Connector (MXM314-92p2x9p6-0p5-socket_WH.P107), USB (C132.2 R72.2 U11.26)
NetD1_2: Button (D1.2), Connector (MXM314-92p2x9p6-0p5-socket_WH.S86)
NetD2_2: Button (D2.2), Connector (MXM314-92p2x9p6-0p5-socket_WH.S90)
NetD3_2: Button (D3.2), Connector (MXM314-92p2x9p6-0p5-socket_WH.S87)
NetD4_2: Button (D4.2), Connector (MXM314-92p2x9p6-0p5-socket_WH.S94)
NetD5_2: Button (D5.2), Connector (MXM314-92p2x9p6-0p5-socket_WH.S88)
NetD6_2: Button (D6.2), Connector (MXM314-92p2x9p6-0p5-socket_WH.S96)
NetD7_2: Button (D7.2), Connector (MXM314-92p2x9p6-0p5-socket_WH.S101)
NetD8_2: Button (D8.2), Connector (MXM314-92p2x9p6-0p5-socket_WH.S89)
NetJ11_16: Connector (MXM314-92p2x9p6-0p5-socket_WH.S104), LVDS (J11.16)
NetJ11_17: Connector (MXM314-92p2x9p6-0p5-socket_WH.S105), LVDS (J11.17)
NetJ11_19: Connector (MXM314-92p2x9p6-0p5-socket_WH.P69), LVDS (J11.19)
NetJ11_21: I2C (R63.2), LVDS (J11.21)
NetJ11_22: I2C (R62.2), LVDS (J11.22)
NetJ12_4: Connector (MXM314-92p2x9p6-0p5-socket_WH.P106), USB (J12.4)
NetJ14_3: Button (J14.3 R91.2), Connector (MXM314-92p2x9p6-0p5-socket_WH.S132)
NetJ14_5: Button (J14.5 R90.2), Connector (MXM314-92p2x9p6-0p5-socket_WH.S130)
NetJ14_7: Button (J14.7 R89.2), Connector (MXM314-92p2x9p6-0p5-socket_WH.S131)
NetJ14_9: Button (J14.9 R88.2), Connector (MXM314-92p2x9p6-0p5-socket_WH.S129)
NetJ14_13: Button (J14.13), Connector (MXM314-92p2x9p6-0p5-socket_WH.S128)
NetMXM314-92p2x9p6-0p5-socket_WH_P4: Connector (MXM314-92p2x9p6-0p5-socket_WH.P4), UART (U1.9)
NetMXM314-92p2x9p6-0p5-socket_WH_P5: Connector (MXM314-92p2x9p6-0p5-socket_WH.P5), UART (U1.11)
NetMXM314-92p2x9p6-0p5-socket_WH_P11: Connector (MXM314-92p2x9p6-0p5-socket_WH.P11), UART (U1.12)
NetMXM314-92p2x9p6-0p5-socket_WH_P12: Connector (MXM314-92p2x9p6-0p5-socket_WH.P12), UART (U1.10)
NetMXM314-92p2x9p6-0p5-socket_WH_P76: Connector (MXM314-92p2x9p6-0p5-socket_WH.P76), Ethernet (R59.2 U8.38)
NetMXM314-92p2x9p6-0p5-socket_WH_P77: Connector (MXM314-92p2x9p6-0p5-socket_WH.P77), Ethernet (R60.2 U8.37)
NetMXM314-92p2x9p6-0p5-socket_WH_P78: Connector (MXM314-92p2x9p6-0p5-socket_WH.P78), Ethernet (U8.41)
NetMXM314-92p2x9p6-0p5-socket_WH_P80: Connector (MXM314-92p2x9p6-0p5-socket_WH.P80), Ethernet (U8.36)
NetMXM314-92p2x9p6-0p5-socket_WH_P81: Connector (MXM314-92p2x9p6-0p5-socket_WH.P81), Ethernet (U8.21)
NetMXM314-92p2x9p6-0p5-socket_WH_P82: Connector (MXM314-92p2x9p6-0p5-socket_WH.P82), Ethernet (U8.20)
NetMXM314-92p2x9p6-0p5-socket_WH_P83: Connector (MXM314-92p2x9p6-0p5-socket_WH.P83), Ethernet (U8.27)
NetMXM314-92p2x9p6-0p5-socket_WH_P84: Connector (MXM314-92p2x9p6-0p5-socket_WH.P84), Ethernet (U8.33)
NetMXM314-92p2x9p6-0p5-socket_WH_P85: Connector (MXM314-92p2x9p6-0p5-socket_WH.P85), Ethernet (U8.25)
NetMXM314-92p2x9p6-0p5-socket_WH_P86: Connector (MXM314-92p2x9p6-0p5-socket_WH.P86), Ethernet (U8.24)
NetMXM314-92p2x9p6-0p5-socket_WH_P87: Connector (MXM314-92p2x9p6-0p5-socket_WH.P87), Ethernet (U8.31)
NetMXM314-92p2x9p6-0p5-socket_WH_P88: Connector (MXM314-92p2x9p6-0p5-socket_WH.P88), Ethernet (U8.19)
NetMXM314-92p2x9p6-0p5-socket_WH_P89: Connector (MXM314-92p2x9p6-0p5-socket_WH.P89), Ethernet (U8.32)
NetMXM314-92p2x9p6-0p5-socket_WH_P90: Connector (MXM314-92p2x9p6-0p5-socket_WH.P90), Ethernet (U8.35)
NetMXM314-92p2x9p6-0p5-socket_WH_P91: Connector (MXM314-92p2x9p6-0p5-socket_WH.P91), Ethernet (U8.28)
NetMXM314-92p2x9p6-0p5-socket_WH_P92: Connector (MXM314-92p2x9p6-0p5-socket_WH.P92), Ethernet (U8.22)
NetMXM314-92p2x9p6-0p5-socket_WH_P141: Connector (MXM314-92p2x9p6-0p5-socket_WH.P141), I2C (R65.1)
NetMXM314-92p2x9p6-0p5-socket_WH_P142: Connector (MXM314-92p2x9p6-0p5-socket_WH.P142), I2C (R66.1)
NetMXM314-92p2x9p6-0p5-socket_WH_P143: Button (R15.1), Connector (MXM314-92p2x9p6-0p5-socket_WH.P143)
NetMXM314-92p2x9p6-0p5-socket_WH_P145: Connector (MXM314-92p2x9p6-0p5-socket_WH.P145), Key-RTC (U2.14)
NetMXM314-92p2x9p6-0p5-socket_WH_S20: Connector (MXM314-92p2x9p6-0p5-socket_WH.S20), I2C (R80.1 R118.1)
NetMXM314-92p2x9p6-0p5-socket_WH_S21: Connector (MXM314-92p2x9p6-0p5-socket_WH.S21), I2C (R79.1 R116.1)
NetMXM314-92p2x9p6-0p5-socket_WH_S23: Connector (MXM314-92p2x9p6-0p5-socket_WH.S23), I2C (R62.1)
NetMXM314-92p2x9p6-0p5-socket_WH_S24: Connector (MXM314-92p2x9p6-0p5-socket_WH.S24), I2C (R63.1)
NetMXM314-92p2x9p6-0p5-socket_WH_S75: Connector (MXM314-92p2x9p6-0p5-socket_WH.S75), Key-RTC (R67.2)
NetMXM314-92p2x9p6-0p5-socket_WH_S92: Button (SW1.3), Connector (MXM314-92p2x9p6-0p5-socket_WH.S92)
NetMXM314-92p2x9p6-0p5-socket_WH_S93: Button (SW1.4), Connector (MXM314-92p2x9p6-0p5-socket_WH.S93)
NetMXM314-92p2x9p6-0p5-socket_WH_S95: Button (R2.1), Connector (MXM314-92p2x9p6-0p5-socket_WH.S95)
NetMXM314-92p2x9p6-0p5-socket_WH_S99: Button (R8.1), Connector (MXM314-92p2x9p6-0p5-socket_WH.S99)
NetMXM314-92p2x9p6-0p5-socket_WH_S100: Button (R14.1), Connector (MXM314-92p2x9p6-0p5-socket_WH.S100)
NetMXM314-92p2x9p6-0p5-socket_WH_S102: Button (R20.1), Connector (MXM314-92p2x9p6-0p5-socket_WH.S102)
NetMXM314-92p2x9p6-0p5-socket_WH_S108: Button (R3.1), Connector (MXM314-92p2x9p6-0p5-socket_WH.S108)
NetMXM314-92p2x9p6-0p5-socket_WH_S109: Button (R9.1), Connector (MXM314-92p2x9p6-0p5-socket_WH.S109)
NetMXM314-92p2x9p6-0p5-socket_WH_S147: Connector (MXM314-92p2x9p6-0p5-socket_WH.S147), HDMI (R78.2 U13.16)
NetR65_2: I2C (R65.2), Key-RTC (U12.5)
NetR66_2: I2C (R66.2), Key-RTC (U12.6)
NetR79_2: HDMI (U13.17), I2C (R79.2)
NetR80_2: HDMI (U13.18), I2C (R80.2)
NetR116_2: I2C (R116.2), Key-RTC (U2.19)
NetR118_2: I2C (R118.2), Key-RTC (U2.20)
USB_HOST_D_N: Connector (MXM314-92p2x9p6-0p5-socket_WH.P101), USB (L9.3)
USB_HOST_D_P: Connector (MXM314-92p2x9p6-0p5-socket_WH.P100), USB (L9.2)
USB_OTG_D_N: Connector (MXM314-92p2x9p6-0p5-socket_WH.P110), USB (L8.1)
USB_OTG_D_P: Connector (MXM314-92p2x9p6-0p5-socket_WH.P109), USB (L8.4)